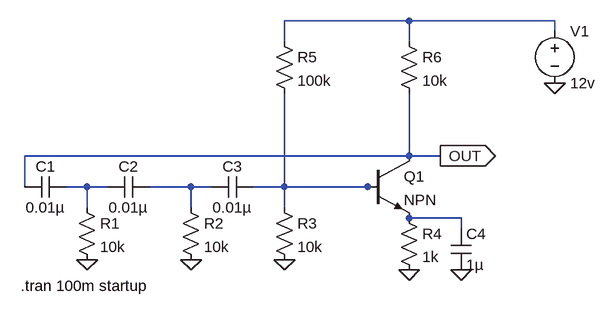
[diagram p0: schematic exp_6_electro.asc]
exp_6_electro.asc, the LTspice schematic file:
Version 4
SHEET 1 980 680
WIRE 688 -224 496 -224
WIRE 912 -224 688 -224
WIRE 912 -208 912 -224
WIRE 496 -192 496 -224
WIRE 688 -192 688 -224
WIRE 688 -16 688 -112
WIRE 688 -16 96 -16
WIRE 736 -16 688 -16
WIRE 96 32 96 -16
WIRE 192 32 160 32
WIRE 224 32 192 32
WIRE 352 32 288 32
WIRE 384 32 352 32
WIRE 496 32 496 -112
WIRE 496 32 448 32
WIRE 624 32 496 32
WIRE 640 32 624 32
WIRE 192 64 192 32
WIRE 352 64 352 32
WIRE 496 64 496 32
WIRE 768 80 688 80
WIRE 768 96 768 80
FLAG 192 144 0
FLAG 352 144 0
FLAG 496 144 0
FLAG 768 160 0
FLAG 688 160 0
FLAG 912 -128 0
FLAG 736 -16 OUT
IOPIN 736 -16 Out
SYMBOL cap 160 16 R90
WINDOW 0 0 32 VBottom 2
WINDOW 3 32 32 VTop 2
SYMATTR InstName C1
SYMATTR Value 0.01µ
SYMBOL cap 288 16 R90
WINDOW 0 0 32 VBottom 2
WINDOW 3 32 32 VTop 2
SYMATTR InstName C2
SYMATTR Value 0.01µ
SYMBOL cap 448 16 R90
WINDOW 0 0 32 VBottom 2
WINDOW 3 32 32 VTop 2
SYMATTR InstName C3
SYMATTR Value 0.01µ
SYMBOL res 176 48 R0
SYMATTR InstName R1
SYMATTR Value 10k
SYMBOL res 336 48 R0
SYMATTR InstName R2
SYMATTR Value 10k
SYMBOL res 480 48 R0
SYMATTR InstName R3
SYMATTR Value 10k
SYMBOL npn 624 -16 R0
SYMATTR InstName Q1
SYMBOL res 672 64 R0
SYMATTR InstName R4
SYMATTR Value 1k
SYMBOL cap 752 96 R0
SYMATTR InstName C4
SYMATTR Value 1µ
SYMBOL res 480 -208 R0
SYMATTR InstName R5
SYMATTR Value 100k
SYMBOL res 672 -208 R0
SYMATTR InstName R6
SYMATTR Value 10k
SYMBOL voltage 912 -224 R0
WINDOW 123 0 0 Left 0
WINDOW 39 0 0 Left 0
SYMATTR InstName V1
SYMATTR Value 12v
TEXT 90 184 Left 2 !.tran 100m startup

The netlist it stands for:
* exp_6_electro.asc
C1 N002 OUT 0.01µ
C2 N003 N002 0.01µ
C3 N004 N003 0.01µ
R1 N002 0 10k
R2 N003 0 10k
R3 N004 0 10k
Q1 OUT N004 N005 0 NPN
R4 N005 0 1k
C4 N005 0 1µ
R5 N001 N004 100k
R6 N001 OUT 10k
V1 N001 0 12v
.model NPN NPN
.model PNP PNP
.lib standard.bjt
.tran 100m startup
.backanno
.end